# Altium schematic sheet USB-UART Converter.SchDoc: Optoisolated USB to UART Converter
size A4; ApprovedBy: LD Stanton; Author: LD Stanton; CompanyName: University of Cape Town; DrawnBy: Lawrence Stanton; Engineer: Lawrence Stanton; Organization: University of Cape Town; Address1: Department of Electrical Engineering; Address2: Rondebosch; Address3: Cape Town; Address4: South Africa 7701; DocumentNumber: 14; SheetNumber: 14; SheetTotal: 19
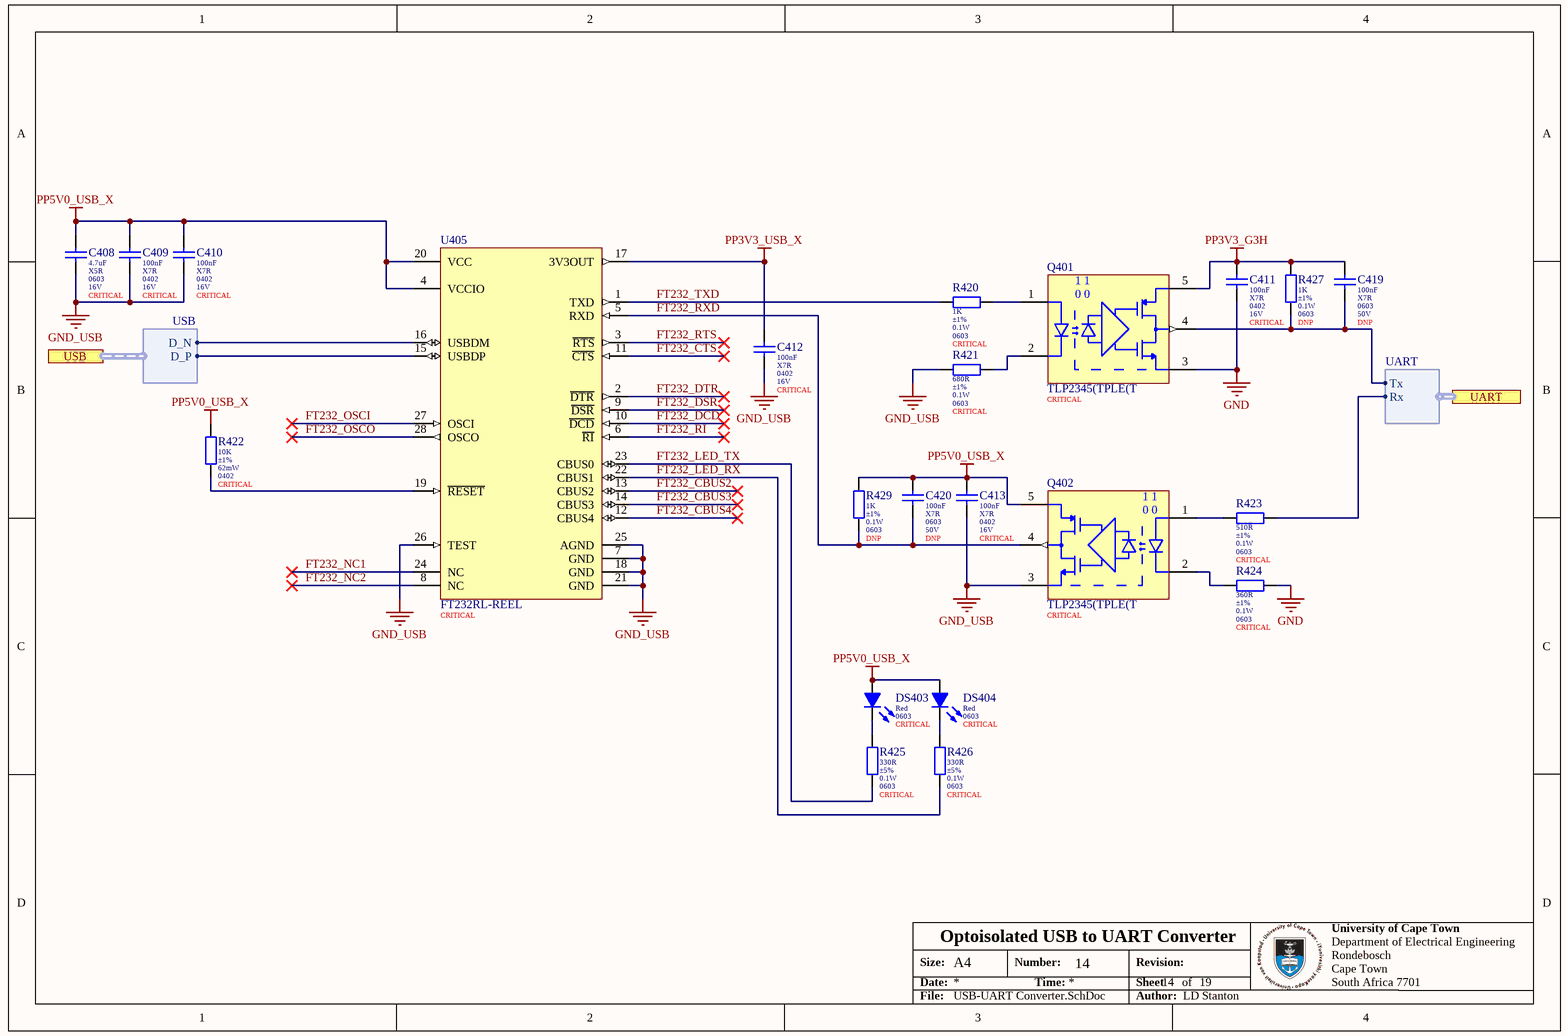
[diagram p0: USB-UART Converter.SchDoc]

## Parts
C408  value 4.7uF  Dielectric: X5R  Package: 0603  Voltage: 16V  Populate: CRITICAL  [0603_080_8 (Samsung) B]  (hidden comment: CL10A475KO8NNNC)
C409  value 100nF  Dielectric: X7R  Package: 0402  Voltage: 16V  Populate: CRITICAL  [0402_050_5 (Samsumg) B]  (hidden comment: CL05B104KO5NNNC)
C410  value 100nF  Dielectric: X7R  Package: 0402  Voltage: 16V  Populate: CRITICAL  [0402_050_5 (Samsumg) B]  (hidden comment: CL05B104KO5NNNC)
C411  value 100nF  Dielectric: X7R  Package: 0402  Voltage: 16V  Populate: CRITICAL  [0402_050_5 (Samsumg) B]  (hidden comment: CL05B104KO5NNNC)
C412  value 100nF  Dielectric: X7R  Package: 0402  Voltage: 16V  Populate: CRITICAL  [0402_050_5 (Samsumg) B]  (hidden comment: CL05B104KO5NNNC)
C413  value 100nF  Dielectric: X7R  Package: 0402  Voltage: 16V  Populate: CRITICAL  [0402_050_5 (Samsumg) B]  (hidden comment: CL05B104KO5NNNC)
C419  value 100nF  Dielectric: X7R  Package: 0603  Voltage: 50V  Populate: DNP  [0603 (Yageo DA) B]  (hidden comment: CC0603KRX7R9BB104)
C420  value 100nF  Dielectric: X7R  Package: 0603  Voltage: 50V  Populate: DNP  [0603 (Yageo DA) B]  (hidden comment: CC0603KRX7R9BB104)
DS403  Colour: Red  Package: 0603  Placement: CRITICAL  [LED 0603 (Everlight) B]  (hidden comment: 19-217/R6C-AL1M2VY/3T)
DS404  Colour: Red  Package: 0603  Placement: CRITICAL  [LED 0603 (Everlight) B]  (hidden comment: 19-217/R6C-AL1M2VY/3T)
Q401  TLP2345(TPLE(T  Placement: CRITICAL  [SO-5 (TLP23) B]
Q402  TLP2345(TPLE(T  Placement: CRITICAL  [SO-5 (TLP23) B]
R420  value 1K  Tolerance: ±1%  Power: 0.1W  Package: 0603  Populate: CRITICAL  [0603 (Uniroyal) B]  (hidden comment: 0603WAF1001T5E)
R421  value 680R  Tolerance: ±1%  Power: 0.1W  Package: 0603  Populate: CRITICAL  [0603 (Uniroyal) B]  (hidden comment: 0603WAF6800T5E)
R422  value 10K  Tolerance: ±1%  Power: 62mW  Package: 0402  Populate: CRITICAL  [0402 (Uniroyal) B]  (hidden comment: 0402WGF1002TCE)
R423  value 510R  Tolerance: ±1%  Power: 0.1W  Package: 0603  Populate: CRITICAL  [0603 (Uniroyal) B]  (hidden comment: 0603WAF5100T5E)
R424  value 360R  Tolerance: ±1%  Power: 0.1W  Package: 0603  Populate: CRITICAL  [0603 (Uniroyal) B]  (hidden comment: 0603WAF3600T5E)
R425  value 330R  Tolerance: ±5%  Power: 0.1W  Package: 0603  Populate: CRITICAL  [0603 (Uniroyal) B]  (hidden comment: 0603WAJ0331T5E)
R426  value 330R  Tolerance: ±5%  Power: 0.1W  Package: 0603  Populate: CRITICAL  [0603 (Uniroyal) B]  (hidden comment: 0603WAJ0331T5E)
R427  value 1K  Tolerance: ±1%  Power: 0.1W  Package: 0603  Populate: DNP  [0603 (Uniroyal) B]  (hidden comment: 0603WAF1001T5E)
R429  value 1K  Tolerance: ±1%  Power: 0.1W  Package: 0603  Populate: DNP  [0603 (Uniroyal) B]  (hidden comment: 0603WAF1001T5E)
U405  FT232RL-REEL  Placement: CRITICAL  [SSOP-28 (FT232) B]

## Ports
UART (harness UART), USB (harness USB)

## Harnesses
UART: Rx, Tx
USB: D_P, D_N

## Nets
GND: C411.2 Q401.3(GND) R424.2
GND_USB: C408.2 C409.2 C410.2 C412.2 C413.2 Q402.3(GND) R421.1 U405.7(GND) U405.18(GND) U405.21(GND) U405.25(AGND) U405.26(TEST)
PP3V3_G3H: C411.1 C419.1 Q401.5(VDD) R427.2
PP3V3_USB_X: C412.1 U405.17(3V3OUT)
PP5V0_USB_X: C408.1 C409.1 C410.1 C413.1 C420.1 DS403.A DS404.A Q402.5(VDD) R422.1 R429.2 U405.4(VCCIO) U405.20(VCC)
FT232_CBUS2: U405.13(CBUS2)
FT232_CBUS3: U405.14(CBUS3)
FT232_CBUS4: U405.12(CBUS4)
FT232_CTS: U405.11(~{CTS})
FT232_DCD: U405.10(~{DCD})
FT232_DSR: U405.9(~{DSR})
FT232_DTR: U405.2(~{DTR})
FT232_LED_RX: R426.2 U405.22(CBUS1)
FT232_LED_TX: R425.2 U405.23(CBUS0)
FT232_NC1: U405.24(NC)
FT232_NC2: U405.8(NC)
FT232_OSCI: U405.27(OSCI)
FT232_OSCO: U405.28(OSCO)
FT232_RI: U405.6(~{RI})
FT232_RTS: U405.3(~{RTS})
FT232_RXD: C420.2 Q402.4(VO) R429.1 U405.5(RXD)
FT232_TXD: R420.1 U405.1(TXD)
NetC419_2: C419.2 Q401.4(VO) R427.1 ; port UART.Tx
NetDS403_K: DS403.K R425.1
NetDS404_K: DS404.K R426.1
NetQ401_1: Q401.1(A) R420.2
NetQ401_2: Q401.2(C) R421.2
NetQ402_1: Q402.1(A) R423.1
NetQ402_2: Q402.2(C) R424.1
NetR422_2: R422.2 U405.19(~{RESET})
NetR423_2: R423.2 ; port UART.Rx
NetU405_15: U405.15(USBDP) ; port USB.D_P
NetU405_16: U405.16(USBDM) ; port USB.D_N

## Notes on the sheet
- Size:
- Date:
- A4
- Number:
- Time:
- Revision:
- Sheet
- of
- File:
- Author:
- (in symbol CMP-00026-00001-2) 1 1; 0 0

## Library data of the parts
C408 = CMP-014-000007-5: MLCC 4.7uF 0603 16V X5R ±10%; Manufacturer: Samsung; LCSC Part Number: C19666; ComponentLink1Description: Datasheet; Tolerance: ±10%; ComponentLink1URL: https://datasheet.lcsc.com/szlcsc/Samsung-Electro-Mechanics-CL05C100JB5NNNC_C32949.pdf
C409-C413 = CMP-045-000014-12: MLCC 100nF 0402 16V X7R ±10%; Manufacturer: Samsung; ComponentLink1Description: Datasheet; ComponentLink1URL: https://datasheet.lcsc.com/szlcsc/Samsung-Electro-Mechanics-CL05C100JB5NNNC_C32949.pdf; LCSC Part Number: C1525; Tolerance: ±10%
C419 C420 = CMP-047-000000-7: MLCC 100nF 50V 0603 X7R ±10%; Manufacturer: Yageo; LCSC Part Number: C14663; Tolerance: ±10%; ComponentLink1URL: https://datasheet.lcsc.com/szlcsc/YAGEO-CC0603KRX7R9BB104_C14663.pdf; ComponentLink1Description: Datasheet
DS403 DS404 = CMP-007-00000-1: LED 0603 SMT Red; Manufacturer: Everlight; Maximum Forward Current: 20mA; Forward Voltage: 2.2V; ComponentLink1Description: Datasheet; RoHS Compliant: Yes; ComponentLink1URL: https://datasheet.lcsc.com/lcsc/1811101510_Everlight-Elec-19-217-R6C-AL1M2VY-3T_C72044.pdf; LCSC Part Number: C72044
Q401 Q402 = CMP-00026-00001-2: Optocoupler Logic-Out Totem-Pole Logic, Buffer-IN 1-CH 5-Pin SO T/R; Isolation Voltage: 3.75kV; Output Current: ±50mA; Forward Voltage: 1V55; Propagation Delay: 120ns; Forward Current: 2mA; ComponentLink1Description: Datasheet; Case/Package: SO; Min Operating Temperature: -40°C; ComponentLink1URL: https://datasheet.lcsc.com/lcsc/1811092313_TOSHIBA-TLP2345-TPL,E_C99484.pdf; Max Operating Temperature: 110°C; LCSC Part Number: C99484; RoHS Compliant: Yes
R420 R427 R429 = CMP-010-000308-10: Resistor 1K0 0603 ±1% Thick Film Uniroyal; Working Voltage: 50V; Temperature Coefficient: ±100ppm/K; ComponentLink1URL: https://datasheet.lcsc.com/szlcsc/1811062009_UNI-ROYAL-Uniroyal-Elec-0603WAF1002T5E_C25804.pdf; LCSC Part Number: C21190; Pin Count: 2; Manufacturer: Uniroyal; ComponentLink1Description: Datasheet; Temperature: -55 - 155°C
R421 = CMP-010-000394-2: Resistor 680R 0603 ±1% Thick Film Uniroyal; Working Voltage: 50V; Temperature Coefficient: ±100ppm/K; ComponentLink1Description: Datasheet; Pin Count: 2; ComponentLink1URL: https://datasheet.lcsc.com/szlcsc/1811062009_UNI-ROYAL-Uniroyal-Elec-0603WAF1002T5E_C25804.pdf; Temperature: -55 - 155°C; Manufacturer: Uniroyal; LCSC Part Number: C23228
R422 = CMP-010-000292-12: Resistor 10K 0402 ±1% Thick Film Uniroyal; Working Voltage: 50V; Temperature Coefficient: ±100ppm/K; Manufacturer: Uniroyal; Pin Count: 2; ComponentLink1URL: https://datasheet.lcsc.com/szlcsc/1811062009_UNI-ROYAL-Uniroyal-Elec-0603WAF1002T5E_C25804.pdf; LCSC Part Number: C25744; Temperature: -55 - 155°C; ComponentLink1Description: Datasheet
R423 = CMP-010-000390-1: Resistor 510R 0603 ±1% Thick Film Uniroyal; Temperature Coefficient: ±200ppm/K; Working Voltage: 50V; Pin Count: 2; LCSC Part Number: C23193; ComponentLink1URL: https://datasheet.lcsc.com/szlcsc/1811062009_UNI-ROYAL-Uniroyal-Elec-0603WAF1002T5E_C25804.pdf; Temperature: -55 - 155°C; Manufacturer: Uniroyal; ComponentLink1Description: Datasheet
R424 = CMP-010-000392-1: Resistor 360R 0603 ±1% Thick Film Uniroyal; Working Voltage: 50V; Temperature Coefficient: ±200ppm/K; ComponentLink1URL: https://datasheet.lcsc.com/szlcsc/1811062009_UNI-ROYAL-Uniroyal-Elec-0603WAF1002T5E_C25804.pdf; LCSC Part Number: C25194; Temperature: -55 - 155°C; Pin Count: 2; Manufacturer: Uniroyal; ComponentLink1Description: Datasheet
R425 R426 = CMP-010-000330-10: Resistor 330R 0603 ±5% Thick Film Uniroyal; Temperature Coefficient: ±100ppm/K; Working Voltage: 50V; ComponentLink1Description: Datasheet; ComponentLink1URL: https://datasheet.lcsc.com/szlcsc/1811062009_UNI-ROYAL-Uniroyal-Elec-0603WAF1002T5E_C25804.pdf; Manufacturer: Uniroyal; Pin Count: 2; Temperature: -55 - 155°C; LCSC Part Number: C23138
U405 = CMP-049-000000-2: USB/UART Converter USB FS SSOP-28 FTDI; Pin Count: 28; LCSC Part Number: C8690; ComponentLink1Description: Datasheet; ComponentLink1URL: https://www.ftdichip.com/Support/Documents/DataSheets/ICs/DS_FT232R.pdf